# EAGLE design input module (EAGLE 7.7.0)
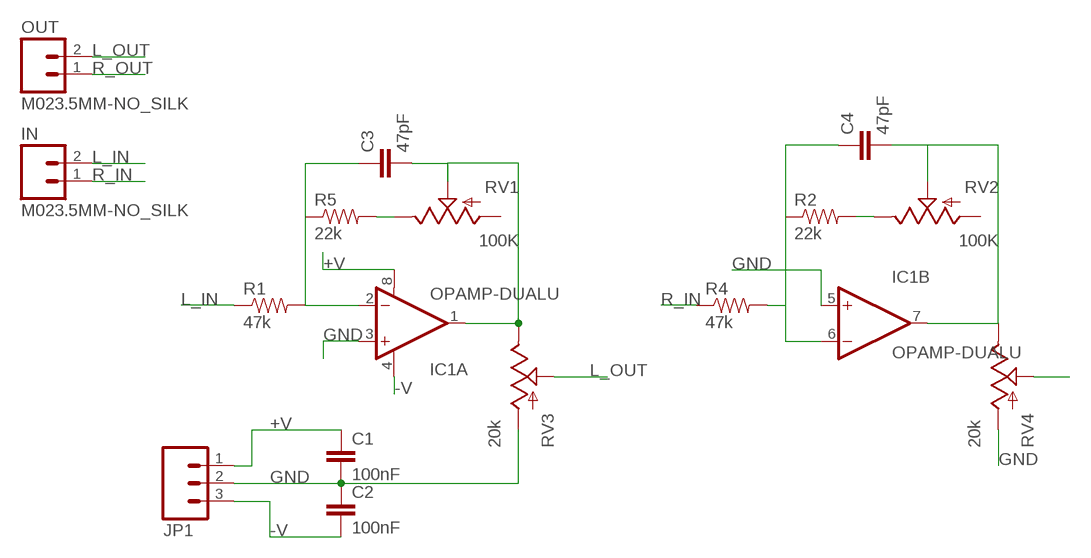
[diagram p0: schematic, sheet 1]

## Parts
C1  100nF  CAP1206  [1206]
C2  100nF  CAP1206  [1206]
C3  47pF  CAP0805  [0805]
C4  47pF  CAP0805  [0805]
IC1  OPAMP-DUALU  [SO08]
IN  M023.5MM-NO_SILK  [SCREWTERMINAL-3.5MM-2-NS]
JP1  M03SCREW  [SCREWTERMINAL-3.5MM-3]
OUT  M023.5MM-NO_SILK  [SCREWTERMINAL-3.5MM-2-NS]
R1  47k  RESISTORPTH-1/4W  [AXIAL-0.4]
R2  22k  RESISTORPTH-1/4W  [AXIAL-0.4]
R4  47k  RESISTORPTH-1/4W  [AXIAL-0.4]
R5  22k  RESISTORPTH-1/4W  [AXIAL-0.4]
RV1  100K  POTTRIM  [TRIM_POT]
RV2  100K  POTTRIM  [TRIM_POT]
RV3  20k  POT  [ALPS_POT]
RV4  20k  POT  [ALPS_POT]

## Nets
+V: C1.1 IC1.8(A:V+) JP1.1
-V: C2.2 IC1.4(A:V-) JP1.3
GND: C1.2 C2.1 IC1.3(A:+IN) IC1.5(B:+IN) JP1.2 RV3.P$3(A) RV4.P$3(A)
L_IN: IN.2 R1.P$1
L_OUT: OUT.2 RV3.P$2(S)
N$1: R5.P$2 RV1.2(E)
N$2: C3.1 IC1.2(A:-IN) R1.P$2 R5.P$1
N$3: C4.1 IC1.6(B:-IN) R2.P$1 R4.P$2
N$4: R2.P$2 RV2.2(E)
N$5: C4.2 IC1.7(B:OUT) RV2.1(S) RV4.P$1(E)
N$7: C3.2 IC1.1(A:OUT) RV1.1(S) RV3.P$1(E)
R_IN: IN.1 R4.P$1
R_OUT: OUT.1 RV4.P$2(S)
Unconnected: RV1.3(A) RV2.3(A)

## Library data of the parts
C1 C2 = SparkFun-Capacitors:CAP: Capacitor Standard 0603 ceramic capacitor, and 0.1" leaded capacitor.
C3 C4 = SparkFun-Passives:CAP: Capacitor Standard 0603 ceramic capacitor, and 0.1" leaded capacitor.
IC1 = SparkFun-AnalogIC:OPAMP-DUAL: Generic op-amp footprint
IN OUT = SparkFun-Connectors:M02: Standard 2-pin 0.1" header. Use with - straight break away headers ( PRT-00116) - right angle break away headers (PRT-00553) - swiss pins (PRT-00743) - machine pins (PRT-00117) - female headers (PRT-00115) Molex polarized connector foot print use with: PRT-08233 with associated crimp pins and housings. 2.54_SCREWTERM for use with PRT-10571. 3.5mm Screw Terminal footprints for PRT-08084 5mm Screw Terminal footprints for use with PRT-08433
JP1 = SparkFun-Connectors:M03: Header 3 Standard 3-pin 0.1" header. Use with straight break away headers (SKU : PRT-00116), right angle break away headers (PRT-00553), swiss pins (PRT-00743), machine pins (PRT-00117), and female headers (PRT-00115). Molex polarized connector foot print use with SKU : PRT-08232 with associated crimp pins and housings.
R1 R2 R4 R5 = SparkFun-Passives:RESISTOR: Resistor Basic schematic elements and footprints for 0603, 1206, and PTH resistors.
RV1-RV4 = SparkFun-Electromechanical:POT

## Board
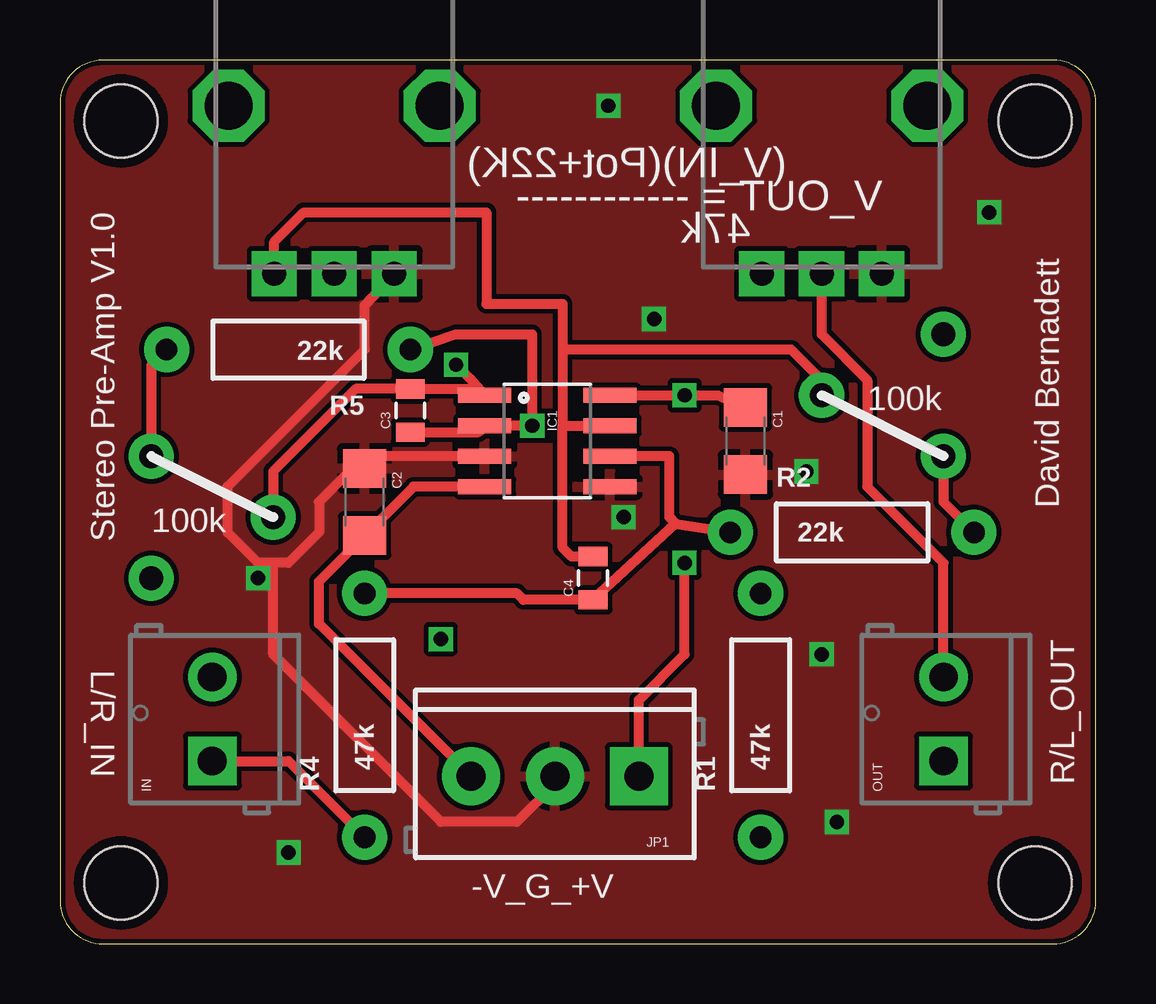
[diagram p1: board, top side]
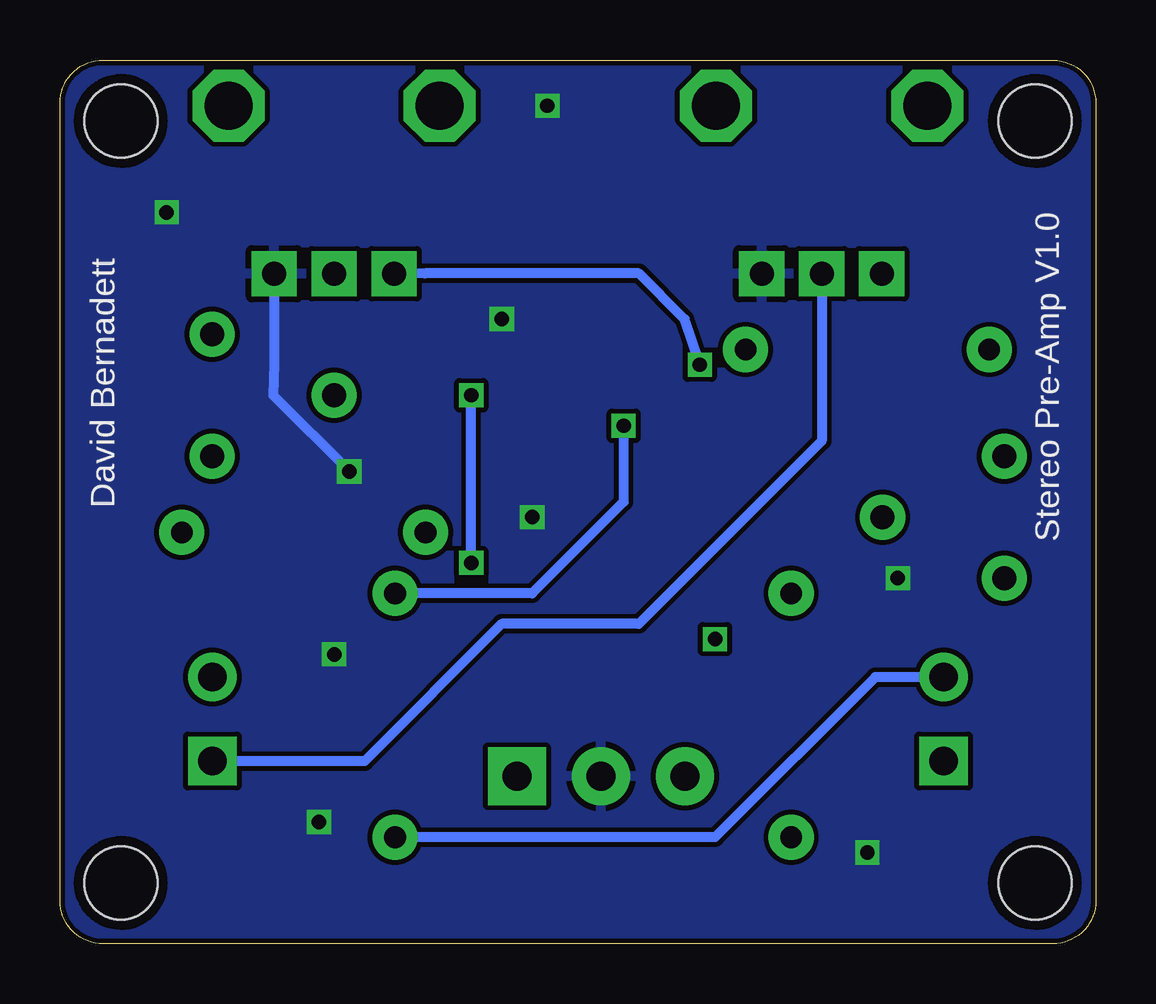
[diagram p2: board, bottom side, seen from below]

Size 43.18 x 36.83 mm. Coordinates in mm from the lower left corner, seen from the top.
Outline: 0,35.03 0,1.8 arc90 1.8,0 41.38,0 arc90 43.18,1.8 43.18,35.03 arc90 41.38,36.83 1.79,36.82 arc90 0,35.03
Copper layers (1*16): Top 0.035mm / dielectric 1.5mm / Bottom 0.035mm
Design rules "default *": minimum track width 10mil, minimum drill 24mil, track to track 8mil, track to pad 8mil, pad to pad 8mil, via to via 8mil, smd to smd 8mil, copper to edge 8mil, drill to drill 8mil, minimum pad ring 10mil, minimum via ring 8mil, stop-mask expansion 4mil, vias tented up to drill 0mil, thermal gap 10mil

### Footprints (pad centres in the part's own frame; a part is rotated, then mirrored left to right if it is on the bottom)
1206 = smd 1.6 x 1.8: 1 -1.4,0; 2 1.4,0
0805 = smd 0.8 x 1.2: 1 -0.9,0; 2 0.9,0
SO08 = smd 0.61 x 2.21: 1 -1.905,-2.616; 2 -0.635,-2.616; 3 0.635,-2.616; 4 1.905,-2.616; 5 1.905,2.616; 6 0.635,2.616; 7 -0.635,2.616; 8 -1.905,2.616
SCREWTERMINAL-3.5MM-2-NS = drill 1.2 pad 2.032 square: 1 0,0 | drill 1.2 pad 2.032: 2 3.5,0
SCREWTERMINAL-3.5MM-3 = drill 1.2 pad 2.413 square: 1 0,0 | drill 1.2 pad 2.413: 2 3.5,0; 3 7,0
AXIAL-0.4 = drill 0.9 pad 1.88: P$1 -5.08,0; P$2 5.08,0
TRIM_POT = drill 1 pad 1.88: 1 5.08,0; 2 0,2.54; 3 0,-2.54
ALPS_POT = drill 1 pad 1.88 square: P$1 7,-2.5; P$2 7,0; P$3 7,2.5 | drill 2 octagon: P$4 0,-4.4; P$5 0,4.4
STAND-OFF-TIGHT = hole 3.048: 0,0

### Placement (x,y rotation side)
C1  28.57,20.95 270 top
C2  12.7,18.41 270 top
C3  14.61,22.22 90 top
C4  22.22,15.24 90 top
IC1  20.32,20.95 270 top
IN  6.35,7.62 90 top
JP1  24.13,6.99 180 top
OUT  36.83,7.62 90 top
R1  29.21,9.53 90 top
R2  33.02,17.14 0 top
R4  12.7,9.53 90 top
R5  9.53,24.77 180 top
RV1  3.81,17.78 0 top
RV2  36.83,22.86 180 top
RV3  31.75,34.92 270 top
RV4  11.43,34.92 270 top
U$1  [STAND-OFF-TIGHT]  2.54,2.54 0 top
U$2  [STAND-OFF-TIGHT]  40.64,2.54 0 top
U$3  [STAND-OFF-TIGHT]  40.64,34.29 0 top
U$4  [STAND-OFF-TIGHT]  2.54,34.29 0 top

### Tracks (layer width: path | path; a pad name or v marks a point on that pad's centre or on a via)
+V  (via drill 0.6)
  Top 0.406: IC1.8 v26.04,22.86 27.43,22.86 C1.1 | JP1.1 24.13,10.16 26.04,12.07 v26.04,15.88
  Bottom 0.406: v26.04,15.88 v26.04,22.86
-V
  Top 0.406: IC1.4 14.73,19.05 C2.2 10.8,15.11 10.8,13.34 JP1.3
GND  (via drill 0.6)
  Top 0.406: 8.89,15.88 9.53,15.88 10.8,17.14 10.8,18.41 12.2,19.81 C2.1 13.2,20.32 IC1.3 | 8.89,15.88 8.25,15.88 6.99,17.14 6.99,19.05 12.7,24.77 12.7,26.61 RV4.P$3 | 28.07,19.68 C1.2 28.57,19.68 | JP1.2 20.63,6.66 19.05,5.08 15.88,5.08 8.89,12.07 8.89,15.88
  Bottom 0.406: RV3.P$3 34.25,24.17 34.29,22.86 v31.11,19.68
  other vias: 9.53,3.81 32.38,5.08 31.75,12.07 8.25,15.24 24.77,26.04 22.86,34.92 38.73,30.48 23.49,17.78
  pour Bottom: 0,36.83 43.18,36.83 43.18,0 0,0
  pour Top: 0,36.83 0,0 43.18,0 43.18,36.83
L_IN
  Bottom 0.406: IN.2 9.2,11.12 15.88,4.45 R1.P$1
L_OUT
  Top 0.406: OUT.2 36.83,15.88 33.66,19.05 33.66,23.49 31.75,25.4 RV3.P$2
N$1
  Top 0.406: R5.P$2 3.81,24.13 RV1.2
N$2  (via drill 0.6)
  Top 0.406: C3.1 17.44,21.32 IC1.2 v19.68,21.59 19.68,25.4 16.51,25.4 R5.P$1
  Bottom 0.406: v19.68,21.59 19.68,18.41 23.49,14.61 R1.P$2
N$3
  Top 0.406: 25.66,17.52 C4.1 19.31,14.34 19.05,14.61 R4.P$2 | 25.66,17.52 R2.P$1 | 25.66,17.52 25.4,17.78 25.4,20.32 IC1.6
N$4
  Top 0.406: RV2.2 36.83,18.41 R2.P$2
N$5
  Top 0.406: RV4.P$1 8.93,29.25 10.16,30.48 17.78,30.48 17.78,26.67 20.95,26.67 20.95,24.77 | 20.95,24.77 20.95,21.59 | 20.95,21.59 IC1.7 | C4.2 21.32,16.14 20.95,16.51 20.95,21.59 | RV2.1 31.75,23.49 30.48,24.77 20.95,24.77
N$7  (via drill 0.6)
  Top 0.406: RV1.1 8.89,19.68 12.33,23.12 C3.2 17.44,23.12 IC1.1 17.07,23.57 v16.51,24.13
  Bottom 0.406: v16.51,24.13 17.14,26.04 19.05,27.94 27.96,27.94 RV3.P$1
N$8  (via drill 0.6)
  other vias: 15.88,12.7
R_IN
  Top 0.406: IN.1 9.53,7.62 R4.P$1
R_OUT
  Bottom 0.406: RV4.P$2 11.43,20.95 19.05,13.34 24.77,13.34 30.48,7.62 OUT.1

### Text on the board
tPlace: Stereo Pre-Amp V1.0 | David Bernadett | R/L_OUT | L/R_IN | -V_G_+V
bPlace: Stereo Pre-Amp V1.0 | David Bernadett
tNames: (V_IN)(Pot+22K) / V_OUT = ------------ / 47k | 100k | 100k